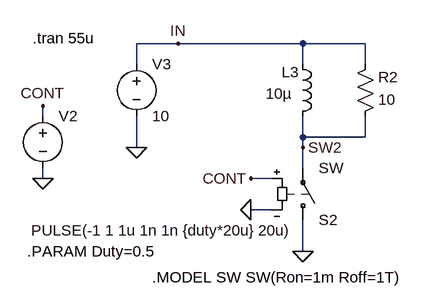
[diagram p0: schematic Fig_7-18_Inductor_SW-Off.asc]
Fig_7-18_Inductor_SW-Off.asc, the LTspice schematic file:
Version 4
SHEET 1 1004 1020
WIRE 160 528 96 528
WIRE 352 528 160 528
WIRE 448 528 352 528
WIRE 96 560 96 528
WIRE 352 560 352 528
WIRE 448 560 448 528
WIRE -48 640 -48 624
WIRE 352 672 352 640
WIRE 448 672 448 640
WIRE 448 672 352 672
WIRE 96 688 96 640
WIRE 352 688 352 672
WIRE 352 720 352 688
WIRE -48 736 -48 720
WIRE 304 736 272 736
WIRE 304 784 272 784
WIRE 352 848 352 800
FLAG -48 624 CONT
FLAG -48 736 0
FLAG 352 848 0
FLAG 272 784 0
FLAG 272 736 CONT
FLAG 352 688 SW2
FLAG 160 528 IN
FLAG 96 688 0
SYMBOL voltage -48 624 R0
WINDOW 3 -18 192 Left 2
WINDOW 123 0 0 Left 2
WINDOW 39 0 0 Left 2
SYMATTR Value PULSE(-1 1 1u 1n 1n {duty*20u} 20u)
SYMATTR InstName V2
SYMBOL ind 336 544 R0
WINDOW 0 -17 28 Left 2
WINDOW 3 -41 61 Left 2
SYMATTR InstName L3
SYMATTR Value 10µ
SYMBOL res 432 656 M180
WINDOW 0 36 76 Left 2
WINDOW 3 36 42 Left 2
SYMATTR InstName R2
SYMATTR Value 10
SYMBOL sw 352 816 M180
SYMATTR InstName S2
SYMBOL voltage 96 544 R0
WINDOW 123 0 0 Left 2
WINDOW 39 0 0 Left 2
SYMATTR InstName V3
SYMATTR Value 10
TEXT -64 520 Left 2 !.tran 55u
TEXT 120 888 Left 2 !.MODEL SW SW(Ron=1m Roff=1T)
TEXT -72 848 Left 2 !.PARAM Duty=0.5

The netlist it stands for:
* Fig_7-18_Inductor_SW-Off.asc
V2 CONT 0 PULSE(-1 1 1u 1n 1n {duty*20u} 20u)
L3 IN SW2 10µ
R2 SW2 IN 10
S2 0 SW2 CONT 0 SW
V3 IN 0 10
.tran 55u
.MODEL SW SW(Ron=1m Roff=1T)
.PARAM Duty=0.5
.backanno
.end